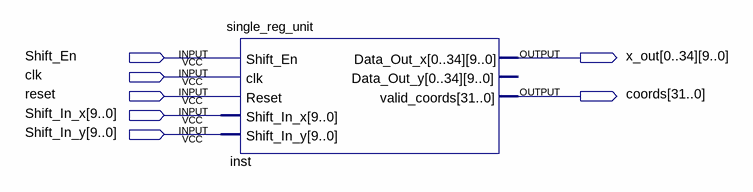
[diagram p0: schematic sheet]
// Quartus schematic dynamicregtest.bdf as structural Verilog: 1 symbols, 7 pins
module dynamicregtest (
  input  Shift_En,
  input  clk,
  input  reset,
  input  [9:0] Shift_In_x,
  input  [9:0] Shift_In_y,
  output [9:0] x_out_0,
  output [9:0] x_out_1,
  output [9:0] x_out_2,
  output [9:0] x_out_3,
  output [9:0] x_out_4,
  output [9:0] x_out_5,
  output [9:0] x_out_6,
  output [9:0] x_out_7,
  output [9:0] x_out_8,
  output [9:0] x_out_9,
  output [9:0] x_out_10,
  output [9:0] x_out_11,
  output [9:0] x_out_12,
  output [9:0] x_out_13,
  output [9:0] x_out_14,
  output [9:0] x_out_15,
  output [9:0] x_out_16,
  output [9:0] x_out_17,
  output [9:0] x_out_18,
  output [9:0] x_out_19,
  output [9:0] x_out_20,
  output [9:0] x_out_21,
  output [9:0] x_out_22,
  output [9:0] x_out_23,
  output [9:0] x_out_24,
  output [9:0] x_out_25,
  output [9:0] x_out_26,
  output [9:0] x_out_27,
  output [9:0] x_out_28,
  output [9:0] x_out_29,
  output [9:0] x_out_30,
  output [9:0] x_out_31,
  output [9:0] x_out_32,
  output [9:0] x_out_33,
  output [9:0] x_out_34,
  output [31:0] coords
);

  single_reg_unit inst (
    .Shift_En(Shift_En), .clk(clk), .Reset(reset), .Shift_In_x(Shift_In_x), .Shift_In_y(Shift_In_y),
    .Data_Out_x({x_out_0, x_out_1, x_out_2, x_out_3, x_out_4, x_out_5, x_out_6, x_out_7, x_out_8, x_out_9, x_out_10, x_out_11, x_out_12, x_out_13, x_out_14, x_out_15, x_out_16, x_out_17, x_out_18, x_out_19, x_out_20, x_out_21, x_out_22, x_out_23, x_out_24, x_out_25, x_out_26, x_out_27, x_out_28, x_out_29, x_out_30, x_out_31, x_out_32, x_out_33, x_out_34}),
    .valid_coords(coords));  // open: Data_Out_y
endmodule
